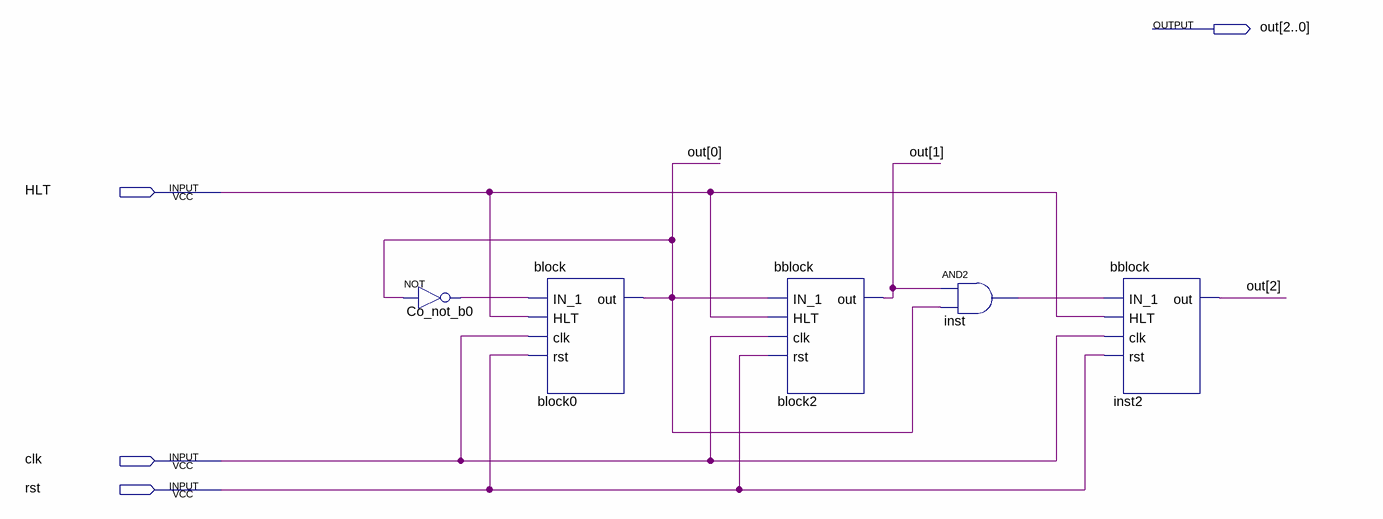
[diagram p0: schematic sheet]
// Quartus schematic synccounter.bdf as structural Verilog: 5 symbols, 4 pins
module synccounter (
  input  HLT,
  input  clk,
  input  rst,
  output [2:0] out
);

  wire Co_not_b0_out, inst_out;

  not Co_not_b0 (Co_not_b0_out, out[0]);
  block block0 (.IN_1(Co_not_b0_out), .HLT(HLT), .clk(clk), .rst(rst), .out(out[0]));
  bblock block2 (.IN_1(out[0]), .HLT(HLT), .clk(clk), .rst(rst), .out(out[1]));
  and inst (inst_out, out[1], out[0]);
  bblock inst2 (.IN_1(inst_out), .HLT(HLT), .clk(clk), .rst(rst), .out(out[2]));
endmodule
